# EasyEDA Pro project ProDoc_Eyes_Brow_Neck_2025-04-16.epro

# Schematic Eye/Brow Lite
Board Name: Eyes/Brow/Neck; Create Date: 2025-03-16; Page Name: P1; Project Name: Robotic Head α2; Schematic Name: Eye/Brow Lite; Update Date: 2025-03-16; Company: EasyEDA.com; Page Size: A4; Version: V1.0
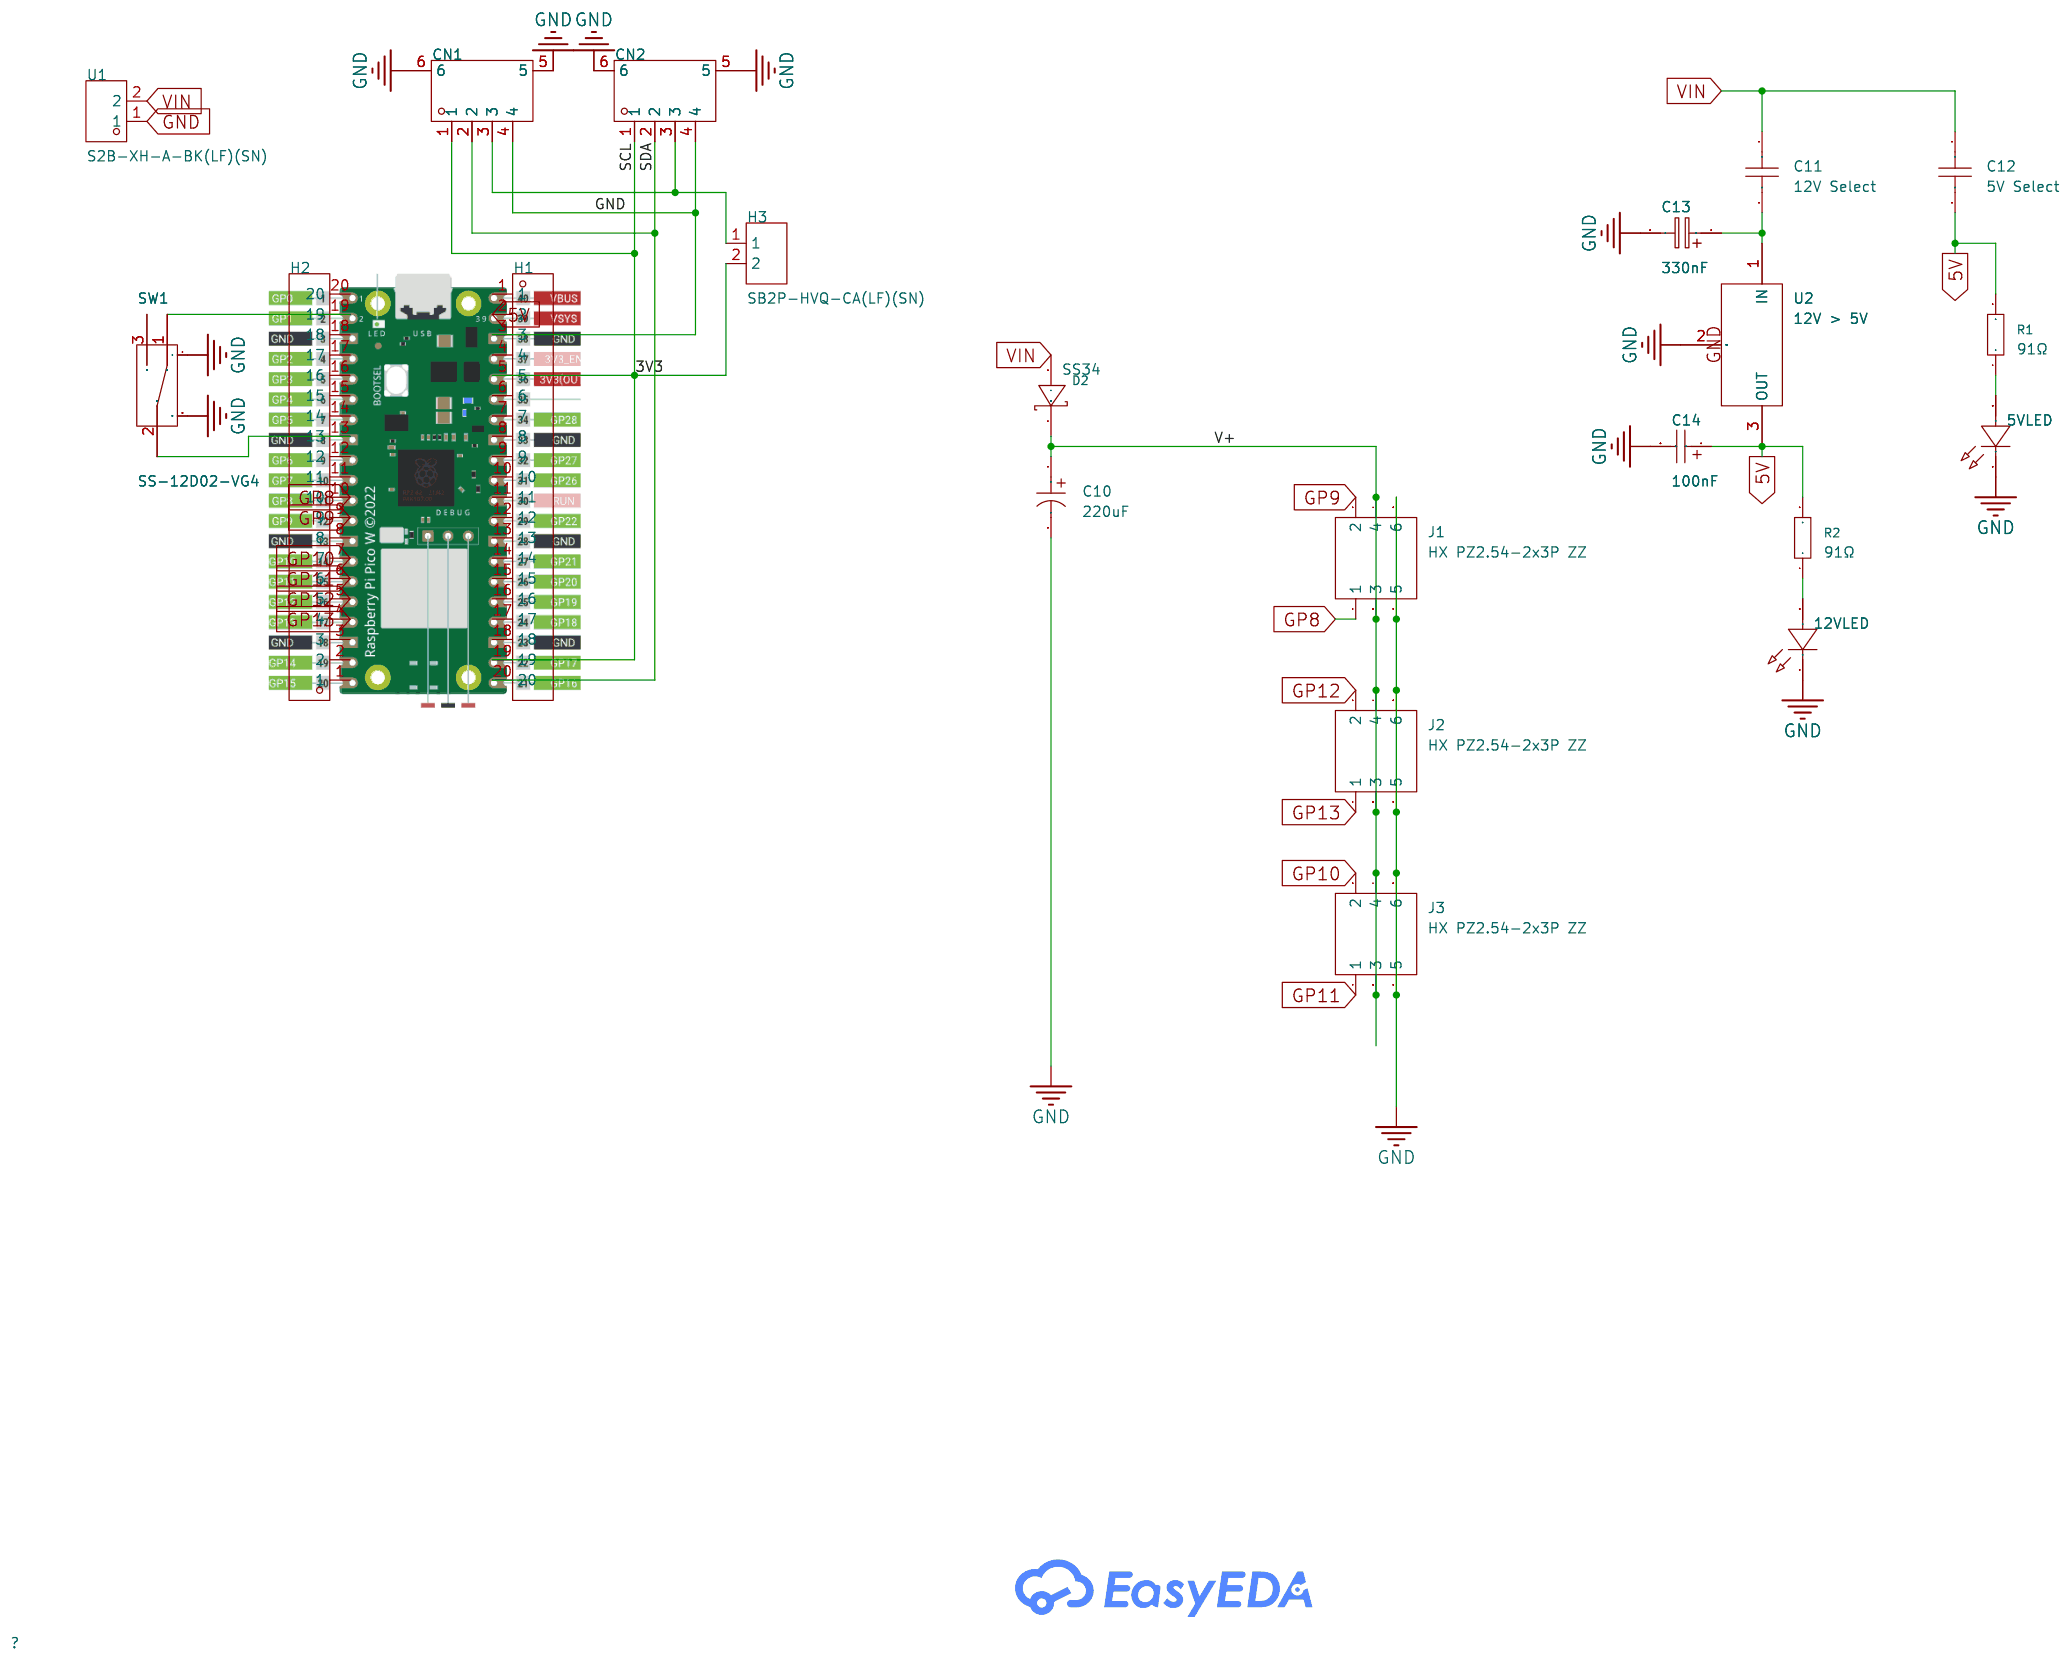
[diagram p0: schematic sheet]

## Parts
5VLED  XL-1608UBC-04  [LED0603-RD_BLUE]
12VLED  XL-1608UBC-04  [LED0603-RD_BLUE]
C10  220uF  [CAP-SMD_BD6.3-L6.6-W6.6-FD]
C11  100nF  [C0805]  (no BOM)
C12  100nF  [C0805]  (no BOM)
C13  330nF  [CAP-SMD_L3.5-W2.8-R-RD]
C14  100nF  [CASE-A_3216]
CN1  HC-1.0-4PWT  [CONN-SMD_4P-P1.00_HCTL_HC-1.0-4PWT]
CN2  HC-1.0-4PWT  [CONN-SMD_4P-P1.00_HCTL_HC-1.0-4PWT]
D2  SS34  [SMA_L4.3-W2.6-LS5.2-RD]
H1  X6511WV-20H-C60D30  [HDR-TH_20P-P2.54-V-M]  (no BOM)
H2  X6511WV-20H-C60D30  [HDR-TH_20P-P2.54-V-M]  (no BOM)
H3  SB2P-HVQ-CA(LF)(SN)  [HDR-TH_2P-P2.54-V-M-1]
J1  HX PZ2.54-2x3P ZZ  [HDR-TH_6P-P2.54-V-M-R2-C3-S2.54-2]
J2  HX PZ2.54-2x3P ZZ  [HDR-TH_6P-P2.54-V-M-R2-C3-S2.54-2]
J3  HX PZ2.54-2x3P ZZ  [HDR-TH_6P-P2.54-V-M-R2-C3-S2.54-2]
R1  91Ω  [R1206]
R2  91Ω  [R1206]
SW1  SS-12D02-VG4  [SW-TH_SS-12D02-VG4]
U1  S2B-XH-A-BK(LF)(SN)  [CONN-TH_S2B-XH-A-LF-SN]
U2  12V > 5V  [TO-252-3_L6.5-W5.8-P4.58-BL]

## Library data of the parts
5VLED 12VLED = XL-1608UBC-04: Lamp Holder Type:- Illumination Color:Blue Voltage - Forward(Vf):3.3V Voltage - Forward(Vf):3.3V Power(Watts):70mW Forward Current:20mA Wavelength - Dominant:455nm~475nm Wavelength - Dominant:455nm~475nm Peak Wavelength:470nm Diode Configuration:- Lens Co; Supplier Part: C965807; Manufacturer: XINGLIGHT(成兴光); Supplier Footprint: 0603; JLCPCB Part Class: Extended Part; Datasheet: https://atta.szlcsc.com/upload/public/pdf/source/20250213/9D28F40E58C3285D8CA3C7212E2FBA3B.pdf; Supplier: LCSC; Illumination Color: Blue; Voltage - Forward(Vf): 3.3V; Power(Watts): 70mW; Forward Current: 20mA; Wavelength - Dominant: 455nm~475nm; Peak Wavelength: 470nm; Lens Color: Colorless Transparent Lens; Luminous Intensity: 300mcd; Viewing Angle: 120°; Mounting Sytle: Positive Stick; Operating Temperature: -20℃~+85℃
C10 = RVT220UF16V67RV0015: Capacitance: Tolerance:±20% Tolerance:±20% Rated Voltage: Ripple Current:110mA@120Hz Equivalent Series Resistance(ESR):- φD: L: Lifetime @ Temp:2000hrs@105℃ Operating Temperature:-55℃~+105℃ Operating Temperature:-55℃~+105℃; LCSC Part Name: 220uF ±20% 16V; Supplier Part: C2887273; Manufacturer: KNSCHA(科尼盛); Supplier Footprint: SMD,D6.3xL7.7mm; JLCPCB Part Class: Extended Part; Datasheet: https://atta.szlcsc.com/upload/public/pdf/source/20210824/3DC9999D9B098FE241E3A26137981C4C.pdf; Supplier: LCSC; Tolerance: ±20%; Ripple Current: 110mA@120Hz; Lifetime @ Temp: 2000hrs@105℃; Operating Temperature: -55℃~+105℃
C11 C12 = CAP_0805: Supplier Footprint: 0805
C13 = T491B334K050AT: Capacitance: Tolerance:±10% Tolerance:±10% Rated Voltage: Equivalent Series Resistance(ESR):10Ω@100kHz Operating Temperature:-55℃~+125℃ Operating Temperature:-55℃~+125℃; LCSC Part Name: 330nF ±10% 50V; Supplier Part: C600509; Manufacturer: KEMET(基美); Supplier Footprint: CASE-B-3528; JLCPCB Part Class: Extended Part; Datasheet: https://atta.szlcsc.com/upload/public/pdf/source/20200414/C513336_DE31AF665D184C14FB01CCA8422E339A.pdf; Supplier: LCSC; Tolerance: ±10%; Equivalent Series Resistance(ESR): 10Ω@100kHz; Operating Temperature: -55℃~+125℃
C14 = TAJA104K035RNJ: Capacitance: Tolerance:±10% Tolerance:±10% Rated Voltage: Equivalent Series Resistance(ESR):24Ω@100kHz Operating Temperature:-55℃~+125℃ Operating Temperature:-55℃~+125℃; LCSC Part Name: 100nF ±10% 35V; Supplier Part: C7173; Manufacturer: Kyocera AVX; Supplier Footprint: CASE-A-3216; JLCPCB Part Class: Extended Part; Datasheet: https://atta.szlcsc.com/upload/public/pdf/source/20160107/1457707750344.pdf; Supplier: LCSC; Tolerance: ±10%; Equivalent Series Resistance(ESR): 24Ω@100kHz; Operating Temperature: -55℃~+125℃
CN1 CN2 = HC-1.0-4PWT: Pins Structure:1x4P Pitch:1mm Mounting Style:Horizontal attachment Reference Series:SH Number of Pins:4P Number of Rows:1 Number of PINs Per Row:4 Row Spacing:- Current Rating (Max):1A Contact Material:Phosphor Bronze Contact Plating:Tin Operating Tempera; LCSC Part Name: 1x4P 间距:1mm 卧贴 系列:SH; Supplier Part: C2845363; Manufacturer: HCTL(华灿天禄); Supplier Footprint: SMD,P=1mm,卧贴; JLCPCB Part Class: Extended Part; Datasheet: https://atta.szlcsc.com/upload/public/pdf/source/20230707/696F47DD5B3D5495B4AB8BCE302E8A84.pdf; Supplier: LCSC; Pins Structure: 1x4P; Pitch: 1mm; Mounting Style: Horizontal attachment; Reference Series: SH; Number of Pins: 4P; Number of Rows: 1; Number of PINs Per Row: 4; Current Rating (Max): 1A; Contact Material: Phosphor Bronze; Contact Plating: Tin; Operating Temperature Range: -25℃~+85℃; Rated Voltage (Max): 50V; Plastic Material: LCP; Flame Retardant Rating: UL94V-0; Supplementary Features: Auxiliary soldering legs; Z-Height of the Board: 3.2mm; X-Length of Bottom Edge on Board (Spacing Line): 6.3mm; Y-Width of Bottom Edge on Board: 5.05mm
D2 = SS34_C8678: Diode Configuration:Independent Type Forward Voltage (Vf@If):550mV@3A Reverse Voltage (Vr):40V Rectified Current:3A Reverse Leakage Current (Ir):500uA@40V; LCSC Part Name: 电压:40V 电流:3A; Supplier Part: C8678; Manufacturer: MDD(辰达半导体); Supplier Footprint: SMA(DO-214AC); JLCPCB Part Class: Basic Part; Datasheet: https://atta.szlcsc.com/upload/public/pdf/source/20240710/2118BB86FDDB2E0B294389AC1F3F65C8.pdf; Supplier: LCSC; Diode Configuration: Independent Type; Forward Voltage (Vf@If): 550mV@3A; Reverse Voltage (Vr): 40V; Rectified Current: 3A; Reverse Leakage Current (Ir): 500uA@40V
H1 H2 = X6511WV-20H-C60D30: Pin Structure:1x20P Pitch:2.54mm Row Spacing:2.54mm Circluar Pins/Square Pins:Square Pins Mounting Type:- Number of Rows:Plugin Number of Pins:20P Current Rating (Max):3A Voltage Rating (Max):250V Length of Mating Pin:- Insulation Height:2.5mm Length of E; LCSC Part Name: 1x20P 间距:2.54mm 方针; Supplier Part: C725952; Manufacturer: XKB Connection(中国星坤); Supplier Footprint: 插件,P=2.54mm; JLCPCB Part Class: Extended Part; Datasheet: https://atta.szlcsc.com/upload/public/pdf/source/20221108/2FDDF9C694C8EDC81165E23F2EAAE597.pdf; Supplier: LCSC; Pin Structure: 1x20P; Pitch: 2.54mm; Row Spacing: 2.54mm; Circluar Pins/Square Pins: Square Pins; Number of Rows: Plugin; Number of Pins: 20P; Current Rating (Max): 3A; Voltage Rating (Max): 250V; Insulation Height: 2.5mm; Contact Plating: Gold; Operating Temperature Range: -40℃~+105℃; Soldering Temperature(Max): 260℃; Color: Black
H3 = SB2P-HVQ-CA(LF)(SN): Pin Structure:1x2P Pitch:2.5mm Row Spacing:- Circluar Pins/Square Pins:- Mounting Type:Straight Number of Rows:Single Row Number of Pins:2P Current Rating:- Voltage Rating (Max):- Length of Mating Pin:7.5mm Insulation Height:3.3mm Length of End Connection; LCSC Part Name: 1x2P 间距:2.5mm 直插; Supplier Part: C157909; Manufacturer: JST; Supplier Footprint: 插件,P=2.5mm; JLCPCB Part Class: Extended Part; Datasheet: https://atta.szlcsc.com/upload/public/pdf/source/20180319/2518302FDF705D922213CC841EAA9FB0.pdf; Supplier: LCSC; Pin Structure: 1x2P; Pitch: 2.5mm; Mounting Type: Straight; Number of Rows: Single Row; Number of Pins: 2P; Length of Mating Pin: 7.5mm; Insulation Height: 3.3mm; Length of End Connection Pin: 3.4mm; Contact Material: Brass; Operating Temperature: -25℃~+85℃; Color: White
J1-J3 = HX PZ2.54-2x3P ZZ: Pin Structure:2x3P Pitch:2.54mm Row Spacing:2.54mm Circluar Pins/Square Pins:Policy Mounting Type:Straight Number of Rows:Double Row Number of Pins:6P Current Rating:3A Voltage Rating (Max):- Length of Mating Pin:6mm Insulation Height:2.5mm Length of End; LCSC Part Name: 2x3P 间距:2.54mm 方针 直插; Supplier Part: C32713276; Manufacturer: hanxia(韩下); Supplier Footprint: 插件,P=2.54mm; JLCPCB Part Class: Extended Part; Datasheet: https://atta.szlcsc.com/upload/public/pdf/source/20240723/3657D920FDF090695A6E017E35381392.pdf; Supplier: LCSC; Pin Structure: 2x3P; Pitch: 2.54mm; Row Spacing: 2.54mm; Circluar Pins/Square Pins: Policy; Mounting Type: Straight; Number of Rows: Double Row; Number of Pins: 6P; Current Rating: 3A; Length of Mating Pin: 6mm; Insulation Height: 2.5mm; Length of End Connection Pin: 3mm; Contact Material: Brass; Contact Plating: Gold; Operating Temperature: -40℃~+105℃; Color: Black
R1 R2 = 1206W4F910JT5E: Type:Thick Film Resistors Resistance:91Ω Tolerance:±1% Tolerance:±1% Power(Watts): Overload Voltage (Max): Temperature Coefficient:±100ppm/℃ Temperature Coefficient:±100ppm/℃ Operating Temperature Range:-55℃~+155℃ Operating Temperature Range:-55℃~+155℃; LCSC Part Name: 91Ω ±1% 250mW 厚膜电阻; Supplier Part: C25346; Manufacturer: UNI-ROYAL(厚声); Supplier Footprint: 1206; JLCPCB Part Class: Extended Part; Datasheet: https://atta.szlcsc.com/upload/public/pdf/source/20200306/C422600_1E6D84923E4A46A82E41ADD87F860B5C.pdf; Supplier: LCSC; Type: Thick Film Resistors; Tolerance: ±1%; Temperature Coefficient: ±100ppm/℃; Operating Temperature Range: -55℃~+155℃
SW1 = SS-12D02-VG4_C136719: Circuit:SPDT Actuator Style:Rectangular columnar Pin Style:PCPin Switch Height:8.7mm Mounting Style:Straight Current Rating (DC):- Voltage Rating (DC):- Current Rating (AC):- Voltage Rating (AC):- Mechanical Life:5千次 Operating Temperature:-25℃~+70℃ Operat; LCSC Part Name: 直插双档 滑动开关; Supplier Part: C136719; Manufacturer: 韩国韩荣; Supplier Footprint: 插件; JLCPCB Part Class: Extended Part; Datasheet: https://atta.szlcsc.com/upload/public/pdf/source/20171030/C136719_15093664985151068208.pdf; Supplier: LCSC; Circuit: SPDT; Actuator Style: Rectangular columnar; Pin Style: PCPin; Switch Height: 8.7mm; Mounting Style: Straight; Mechanical Life: 5千次; Operating Temperature: -25℃~+70℃
U1 = S2B-XH-A-BK(LF)(SN): Pins Structure:1x2P Pitch:2.5mm Mounting Style:Bend insert Reference Series:XH Number of Pins:2P Number of Rows:1 Number of PINs Per Row:2 Row Spacing:- Current Rating (Max):3A Contact Material:Brass Contact Plating:Tin Operating Temperature Range:-25℃~+8; LCSC Part Name: 1x2P 间距:2.5mm 弯插 系列:XH; Supplier Part: C493111; Manufacturer: JST; Supplier Footprint: 弯插,P=2.5mm; JLCPCB Part Class: Extended Part; Datasheet: https://atta.szlcsc.com/upload/public/pdf/source/20210915/55C2150F8D01CCBD7F61D7DC07E45ED6.pdf; Supplier: LCSC; Pins Structure: 1x2P; Pitch: 2.5mm; Mounting Style: Bend insert; Reference Series: XH; Number of Pins: 2P; Number of Rows: 1; Number of PINs Per Row: 2; Current Rating (Max): 3A; Contact Material: Brass; Contact Plating: Tin; Operating Temperature Range: -25℃~+85℃; Rated Voltage (Max): 250V; Plastic Material: PA66; Flame Retardant Rating: UL94V-0; Supplementary Features: K-leg punch; Colour: Black; Z-Height of the Board: 6.1mm; X-Length of Bottom Edge on Board (Spacing Line): 7.4mm; Y-Width of Bottom Edge on Board: 11.5mm
U2 = L78M05CDT-TR: Output Type:Fixed Maximum Input Voltage:35V Output Voltage:5V Output Voltage:5V Output Current:500mA Power Supply Rejection Ratio (PSRR):62dB@(120Hz) Dropout Voltage:- standby current:6mA Feature:Short-Circuit  Protection；Thermal Protection(TSD)；Overcurre; LCSC Part Name: 精密500 mA稳压器; Supplier Part: C55509; Manufacturer: ST(意法半导体); Supplier Footprint: TO-252-2(DPAK); JLCPCB Part Class: Extended Part; Datasheet: https://atta.szlcsc.com/upload/public/pdf/source/20201012/C880081_9A302D558B171428CB016C513D9594F4.pdf; Supplier: LCSC; Output Type: Fixed; Maximum Input Voltage: 35V; Output Voltage: 5V; Output Current: 500mA; Power Supply Rejection Ratio (PSRR): 62dB@(120Hz); standby current: 6mA; Feature: Short-Circuit  Protection；Thermal Protection(TSD)；Overcurrent Protection(OCP); Operating Temperature: 0℃~+150℃; Output Polarity: Positive electrode; Number of Outputs: 1

## Nets
3V3: H1.5 H3.2
5V: C12.2 C14.1 H1.2 R1.2 R2.2 U2.3(OUT)
GND: 5VLED.1(K) 12VLED.1(K) C10.2 C13.2 C14.2 CN1.4 CN1.5 CN1.6 CN2.4 CN2.5 CN2.6 H1.3 J1.5 J1.6 J2.5 J2.6 J3.5 J3.6 SW1.4 SW1.5 U1.1 U2.2(GND)
VIN: C11.1 C12.1 D2.2(A) U1.2
GP8: H2.10 J1.1
GP9: H2.9 J1.2
GP10: H2.7 J3.2
GP11: H2.6 J3.1
GP12: H2.5 J2.2
GP13: H2.4 J2.1
SCL: CN1.1 CN2.1 H1.19
SDA: CN1.2 CN2.2 H1.20
V+: C10.1 D2.1(C) J1.3 J1.4 J2.3 J2.4 J3.3 J3.4
$1N1155: CN1.3 CN2.3 H3.1
$1N1226: H2.13 SW1.2
$1N1232: H2.19 SW1.1
$1N1743: C11.2 C13.1 U2.1(IN)
$1N2236: 5VLED.2(A) R1.1
$1N2349: 12VLED.2(A) R2.1

Not connected (* = marked no-connect by the designer): H1 1 4 6 7 8 9 10 11 12 13 14 15 16 17 18; H2 1 2 3 8 11 12 14 15 16 17 18 20; SW1 3

# Board Eye/Brow/Neck
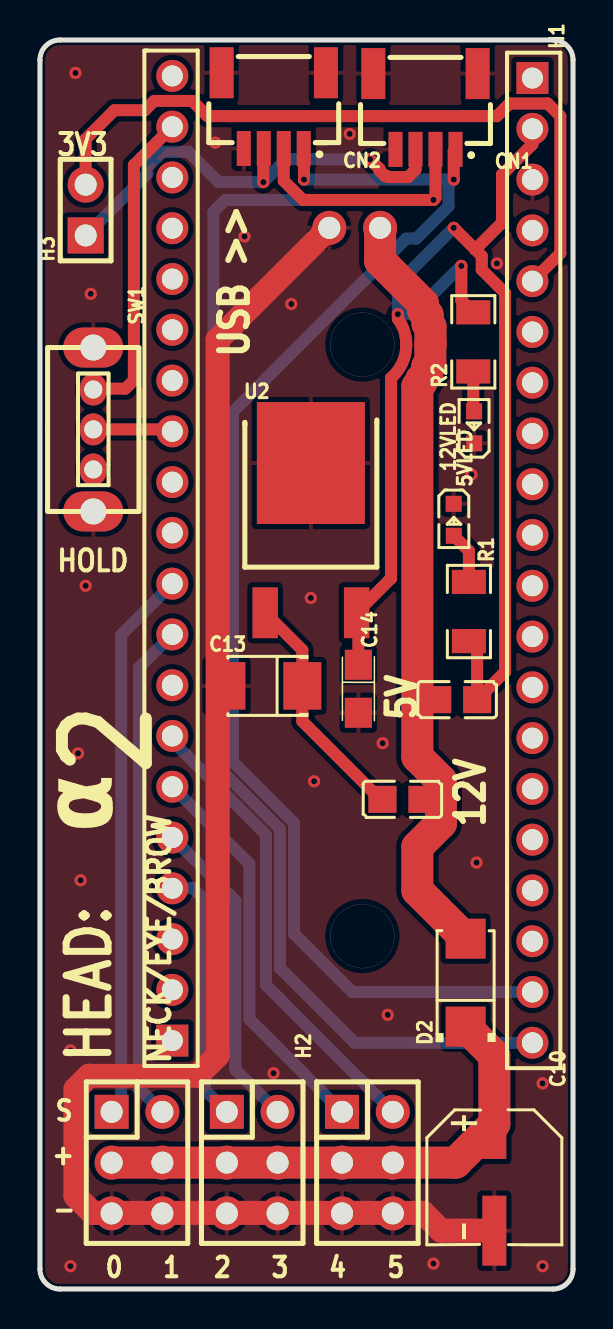
[diagram p1: board, top side]
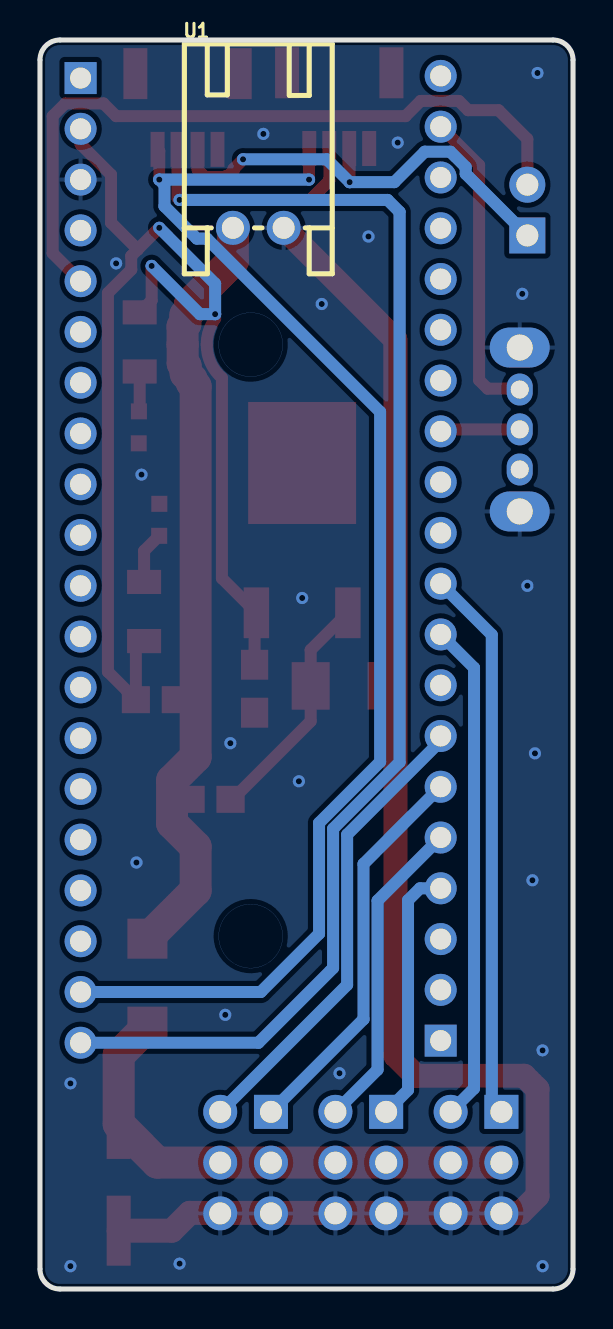
[diagram p2: board, bottom side, seen from below]

Outline 26.67 x 62.48 mm; copper layers: Top Layer, Bottom Layer. Coordinates in mm from the lower left corner of the outline.
Outline path: circle c16.13,47.24 r1.6 ; circle c16.13,17.65 r1.6 ; 0,61.48 0,1 arc(0.29,0.29) 1,0 25.67,0 arc(26.38,0.29) 26.67,1 26.67,61.48 arc(26.38,62.19) 25.67,62.48 1,62.48 arc(0.29,62.19) 0,61.48
Stack: Top Layer 0.035mm / Dielectric1 1.51mm FR4 er 4.5 / Bottom Layer 0.035mm

## Design rules (mm)
template: JLCPCB Capability(Two Layers Board)
spacing copperThickness1oz (default): track to track 0.102, other pairs 0.152 to 0.3
spacing copperThickness2oz: track to track 0.203, other pairs 0.152 to 0.3
track width copperThickness1oz (default): min 0.127, default 0.254, max 2.54
track width copperThickness2oz: min 0.203, default 0.254, max 2.54
differential pair differentialPair (default): width min 0.127, default 0.254, max 2.54; gap min 0.152, default 0.152
via viaSize (default): diameter min 0.5, default 0.61, max 10; hole min 0.3, default 0.305, max 6.3

## Placement (name value [footprint] x y rotation side)
5VLED  XL-1608UBC-04  [LED0603-RD_BLUE]  20.7 38.48 270 top
12VLED  XL-1608UBC-04  [LED0603-RD_BLUE]  21.72 43.11 90 top
C10  220uF  [CAP-SMD_BD6.3-L6.6-W6.6-FD]  22.73 5.59 270 top
C11  100nF  [C0805]  18.13 24.5 180 top
C12  100nF  [C0805]  20.87 29.48 0 top
C13  330nF  [CAP-SMD_L3.5-W2.8-R-RD]  11.23 30.17 0 top
C14  100nF  [CASE-A_3216]  15.93 30.03 270 top
CN1  HC-1.0-4PWT  [CONN-SMD_4P-P1.00_HCTL_HC-1.0-4PWT]  19.29 58.91 180 top
CN2  HC-1.0-4PWT  [CONN-SMD_4P-P1.00_HCTL_HC-1.0-4PWT]  11.7 58.95 180 top
D2  SS34  [SMA_L4.3-W2.6-LS5.2-RD]  21.29 15.33 90 top
H1  X6511WV-20H-C60D30  [HDR-TH_20P-P2.54-V-M]  24.64 36.45 270 top
H2  X6511WV-20H-C60D30  [HDR-TH_20P-P2.54-V-M]  6.62 36.56 90 top
H3  SB2P-HVQ-CA(LF)(SN)  [HDR-TH_2P-P2.54-V-M-1]  2.29 53.97 90 top
J1  HX PZ2.54-2x3P ZZ  [HDR-TH_6P-P2.54-V-M-R2-C3-S2.54-2]  4.85 6.32 270 top
J2  HX PZ2.54-2x3P ZZ  [HDR-TH_6P-P2.54-V-M-R2-C3-S2.54-2]  10.62 6.32 270 top
J3  HX PZ2.54-2x3P ZZ  [HDR-TH_6P-P2.54-V-M-R2-C3-S2.54-2]  16.38 6.32 270 top
R1  91Ω  [R1206]  21.46 33.89 270 top
R2  91Ω  [R1206]  21.68 47.38 90 top
SW1  SS-12D02-VG4  [SW-TH_SS-12D02-VG4]  2.67 43 270 top
U1  S2B-XH-A-BK(LF)(SN)  [CONN-TH_S2B-XH-A-LF-SN]  15.75 53.09 180 bottom
U2  12V > 5V  [TO-252-3_L6.5-W5.8-P4.58-BL]  13.55 37.58 0 top

## Footprints (pads in the part's own frame, mm; a bottom-side part is the same pattern mirrored in y, then rotated)
C0805
  rect 1.41x1.35 smd: 1(-1,0) 2(1,0)
CAP-SMD_BD6.3-L6.6-W6.6-FD
  rect 3.5x1.2 smd: 1(-2.67,0) 2(2.67,0)
CAP-SMD_L3.5-W2.8-R-RD
  rect 1.9x2.376 smd: 1(1.899,0) 2(-1.899,0)
CASE-A_3216
  rect 1.5x1.359 smd: 1(-1.2,0) 2(1.2,0)
CONN-SMD_4P-P1.00_HCTL_HC-1.0-4PWT
  rect 0.7x1.75 smd: 1(-1.5,1.895) 2(-0.5,1.895) 3(0.5,1.895) 4(1.5,1.895)
  rect 1.2x2.55 smd: 5(2.61,-1.895) 6(-2.61,-1.895)
CONN-TH_S2B-XH-A-LF-SN
  round 1.7 hole 1.1: 1(1.27,0) 2(-1.27,0)
HDR-TH_2P-P2.54-V-M-1
  rect 1.8x1.8 hole 1.1: 1(-1.27,0)
  round 1.8 hole 1.1: 2(1.27,0)
HDR-TH_6P-P2.54-V-M-R2-C3-S2.54-2
  rect 1.7x1.7 hole 1.1: 1(-2.54,-1.27)
  round 1.7 hole 1.1: 2(-2.54,1.27) 3(0,-1.27) 4(0,1.27) 5(2.54,-1.27) 6(2.54,1.27)
HDR-TH_20P-P2.54-V-M
  rect 1.6x1.6 hole 1.05: 1(-24.13,0)
  round 1.6 hole 1.05: 2(-21.59,0) 3(-19.05,0) 4(-16.51,0) 5(-13.97,0) 6(-11.43,0) 7(-8.89,0) 8(-6.35,0) 9(-3.81,0) 10(-1.27,0) 11(1.27,0) 12(3.81,0) 13(6.35,0) 14(8.89,0) 15(11.43,0) 16(13.97,0) 17(16.51,0) 18(19.05,0) 19(21.59,0) 20(24.13,0)
LED0603-RD_BLUE
  rect 0.8x0.8 smd: 1(-0.799,-0.004) 2(0.799,0.004)
R1206
  rect 1.208x1.701 smd: 1(-1.479,0) 2(1.479,0)
SMA_L4.3-W2.6-LS5.2-RD
  rect 2x2 smd: 1(-2.2,0) 2(2.2,0)
SW-TH_SS-12D02-VG4
  oval 1.6x1.3 hole 0.9: 1(-2,0) 2(-0.006,0) 3(2,0)
  oval 2x3 hole 1.3: 4(4.1,0) 5(-4.1,0)
TO-252-3_L6.5-W5.8-P4.58-BL
  rect 1.27x2.54 smd: 1(-2.288,-3.747) 3(2.288,-3.745)
  rect 5.4x6.1 smd: 2(-0.002,3.747)

## Nets
As in the schematic.

Pads without a net: H1 1 4 6 7 8 9 10 11 12 13 14 15 16 17 18; H2 1 2 3 8 11 12 14 15 16 17 18 20; SW1 3

## Via types
v1: diameter 0.61, hole 0.305, Top Layer to Bottom Layer, 30 vias

## Routing (per net, layer and track width the routed paths; a pad name or vN(x,y) marks a point on that pad's centre or on a via; arc(x,y) is an arc through that point)
3V3: length 36.5
  Top Layer w0.6: H3.2 2.29,57.53 3.73,58.97 5.25,58.97 5.71,59.43 7.62,59.43 8.38,58.67 22.86,58.67 23.5,59.31 25.4,59.31 26.03,58.67 26.03,51.82 H1.5
5V: length 66.4
  Top Layer w0.6: R2.2 21.08,49.46 v1(21.08,51.18) ; 21.78,52 23.11,53.34 23.11,55.75 24.64,57.27 H1.2 ; 21.78,52 21.78,52.01 v1(20.7,53.09) ; 21.78,52 22.1,51.68 22.1,50.99 23.27,49.83 23.27,30.88 C12.2 21.87,32 R1.2 ; v1(17.91,48.77) 17.91,48.54 arc(17.91,48.53) 17.92,48.52 arc(18.22,47.92) 18.33,47.24 arc(18.13,46.33) 17.57,45.58 17.57,35.55 U2.3 15.93,33.74 C14.1
  Bottom Layer w0.6: v1(20.7,53.09) 17.91,50.29 v1(17.91,48.77) 18.67,48.77 v1(21.08,51.18)
GND: length 78.5
  Top Layer w1.2: U1.1 8.89,47.5 8.89,11.68 7.87,10.67 2.45,10.67 1.78,10 1.78,4.66 2.63,3.81 19.18,3.81 20.07,2.92 C10.2
  vias: v1(1.52,11.94) v1(1.52,1.14) v1(1.78,60.83) v1(1.91,26.8) v1(2.03,20.45) v1(2.29,35.18) v1(2.54,49.78) v1(8.77,57.35) v1(10.24,52.65) v1(11.68,10.8) v1(12.57,49.28) v1(13.55,34.57) v1(13.72,25.4) v1(15.49,57.78) v1(17.14,27.3) v1(17.4,13.72) v1(19.69,1.27) v1(21.59,40.74) v1(21.84,21.34) v1(22.86,51.31) v1(25.15,10.29) v1(25.15,1.14)
VIN: length 38.9
  Top Layer w1.6: D2.2 18.88,19.94 18.88,22.12 20.06,23.3 20.06,25.44 18.88,26.62 18.88,45.15 19.07,45.35 19.07,45.49 19.38,45.8 19.38,46.16 19.53,46.31 19.53,47.24 19.54,47.25 19.54,48.15 19.39,48.29 19.39,48.73 19.16,48.96 19.16,49.29 17.02,51.43 U1.2
GP8: length 27.7
  Bottom Layer w0.6: J1.1 4.06,9.34 4.06,32.73 H2.10
GP9: length 25.1
  Bottom Layer w0.6: J1.2 4.95,10.03 4.95,31.08 H2.9
GP10: length 23.4
  Bottom Layer w0.6: H2.7 6.62,27.41 11.3,22.73 11.3,15.21 J3.2
GP11: length 19.8
  Bottom Layer w0.6: H2.6 10.48,21.27 10.48,13.49 J3.1
GP12: length 15.9
  Bottom Layer w0.6: H2.5 9.78,19.43 9.78,10.97 J2.2
GP13: length 12.9
  Bottom Layer w0.6: J2.1 8.25,9.96 8.25,19.45 7.66,20.05 H2.4
SCL: length 67.6
  Top Layer w0.6: CN1.1 20.7,56.93 v1(20.7,55.5) ; v1(13.21,55.5) 13.21,57.04 CN2.1
  Bottom Layer w0.6: v1(13.21,55.5) v1(20.7,55.5) 20.44,55.24 20.44,54.17 18.82,52.55 18.32,52.55 9.65,43.88 9.65,26.37 12.71,23.31 12.71,17.77 15.62,14.86 H1.19
SDA: length 76.7
  Top Layer w0.6: CN1.2 19.79,54.59 v1(19.69,54.48) 13.15,54.48 12.2,55.44 CN2.2
  Bottom Layer w0.6: v1(19.69,54.48) 9.28,54.48 8.68,53.88 8.68,26.35 12,23.02 12,16.06 15.74,12.32 H1.20
V+: length 25.4
  Top Layer w1.6: J1.3 J1.4 J2.3 J2.4 J3.3 J3.4 20.8,6.32 C10.1 22.73,11.69 D2.1
$1N1155: length 22.8
  Top Layer w0.6: v1(16.51,56.52) 16.99,56.04 16.99,55.95 17.25,55.69 17.34,55.69 17.4,55.63 18.41,55.63 18.79,56 CN1.3 ; v1(11.18,55.37) 11.18,57.03 CN2.3
  Bottom Layer w0.6: v1(16.51,56.52) 12.32,56.52 v1(11.18,55.37) 8.94,55.37 7.42,56.89 6.14,56.89 5.37,56.12 5.37,55.79 H3.1
$1N1226: length 4
  Top Layer w0.6: H2.13 6.52,43 SW1.2
$1N1232: length 15.7
  Top Layer w0.6: H2.19 4.7,56.22 4.7,45.47 4.27,45.04 2.71,45.04 SW1.1
$1N1743: length 11.8
  Top Layer w0.6: C11.2 17.03,24.5 13.13,28.4 C13.1 13.13,31.97 U2.1
$1N2236: length 2.6
  Top Layer w0.6: 5VLED.2 21.46,36.92 21.46,35.37
$1N2349: length 2
  Top Layer w0.6: 12VLED.2 21.68,43.94 R2.1

## Copper pours and planes (outline as drawn; the poured copper is in the pictures)
GND on Top Layer: -2.29,65.91 30.73,65.91 30.73,-2.41 -2.29,-2.41
GND on Bottom Layer: -5.08,66.29 32,66.29 32,-2.67 -5.08,-2.67

## Text on the board
Top Silkscreen Layer: 0 | 1 | 2 | 3 | 4 | 5 | S | + | - | 3V3 | HOLD | NECK/EYE/BROW | USB >> | 12V | 5V | HEAD: | α
